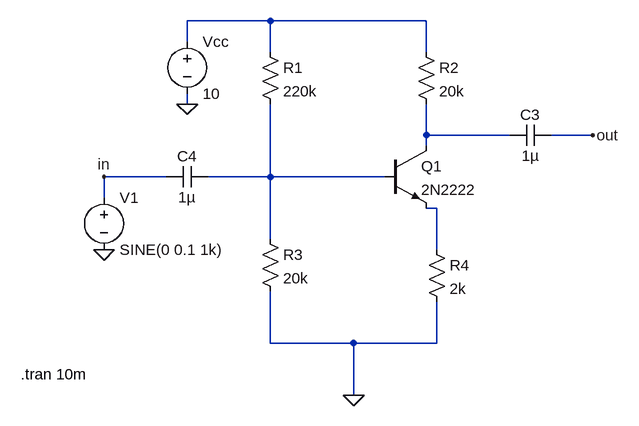
[diagram p0: schematic amplifier_used_in_final_circuit.asc]
amplifier_used_in_final_circuit.asc, the LTspice schematic file:
Version 4
SHEET 1 904 1172
WIRE 192 80 64 80
WIRE 432 80 192 80
WIRE 64 112 64 80
WIRE 192 128 192 80
WIRE 432 128 432 80
WIRE 64 208 64 192
WIRE 432 256 432 208
WIRE 560 256 432 256
WIRE 688 256 624 256
WIRE 432 272 432 256
WIRE 32 320 -64 320
WIRE 192 320 192 208
WIRE 192 320 96 320
WIRE 368 320 192 320
WIRE -64 352 -64 320
WIRE 448 368 432 368
WIRE 192 416 192 320
WIRE 448 432 448 368
WIRE 192 576 192 496
WIRE 320 576 192 576
WIRE 448 576 448 512
WIRE 448 576 320 576
WIRE 320 656 320 576
FLAG 320 656 0
FLAG 64 208 0
FLAG -64 432 0
FLAG 688 256 out
FLAG -64 320 in
SYMBOL res 176 112 R0
SYMATTR InstName R1
SYMATTR Value 220k
SYMBOL res 416 112 R0
SYMATTR InstName R2
SYMATTR Value 20k
SYMBOL res 176 400 R0
SYMATTR InstName R3
SYMATTR Value 20k
SYMBOL res 432 416 R0
SYMATTR InstName R4
SYMATTR Value 2k
SYMBOL npn 368 272 R0
SYMATTR InstName Q1
SYMATTR Value 2N2222
SYMBOL cap 624 240 R90
WINDOW 0 0 32 VBottom 2
WINDOW 3 32 32 VTop 2
SYMATTR InstName C3
SYMATTR Value 1µ
SYMBOL cap 96 304 R90
WINDOW 0 0 32 VBottom 2
WINDOW 3 32 32 VTop 2
SYMATTR InstName C4
SYMATTR Value 1µ
SYMBOL voltage 64 96 R0
SYMATTR InstName Vcc
SYMATTR Value 10
SYMBOL voltage -64 336 R0
WINDOW 123 0 0 Left 0
WINDOW 39 0 0 Left 0
SYMATTR InstName V1
SYMATTR Value SINE(0 0.1 1k)
TEXT -192 624 Left 2 !.tran 10m

The netlist it stands for:
* amplifier_used_in_final_circuit.asc
R1 N001 N003 220k
R2 N001 N002 20k
R3 N003 0 20k
R4 N004 0 2k
Q1 N002 N003 N004 0 2N2222
C3 out N002 1µ
C4 N003 in 1µ
Vcc N001 0 10
V1 in 0 SINE(0 0.1 1k)
.model NPN NPN
.model PNP PNP
.lib standard.bjt
.tran 10m
.backanno
.end